# EAGLE schematic prototype_total_schematic_ultasonic (EAGLE 8.4.1)

## Sheet 1 of 2: Peripherals
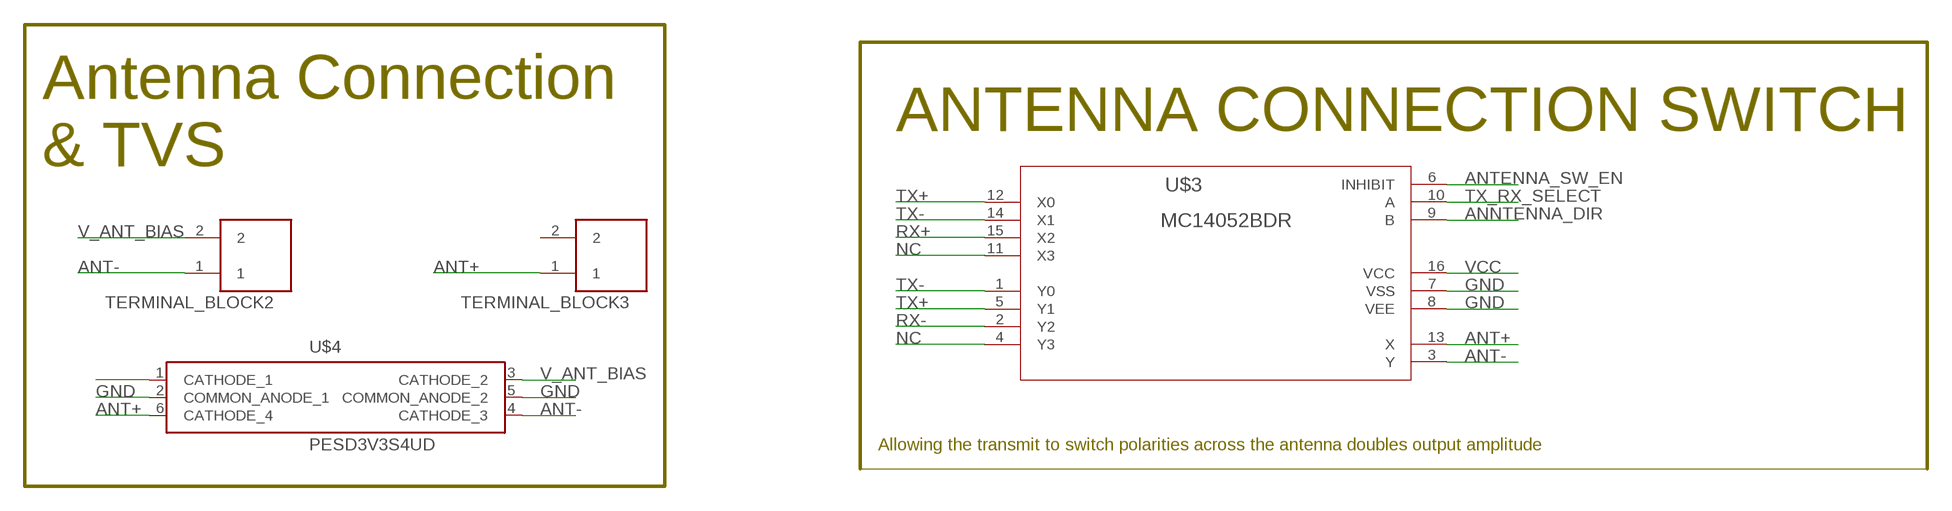
[diagram p0: schematic, sheet 1, part 1 of 2]
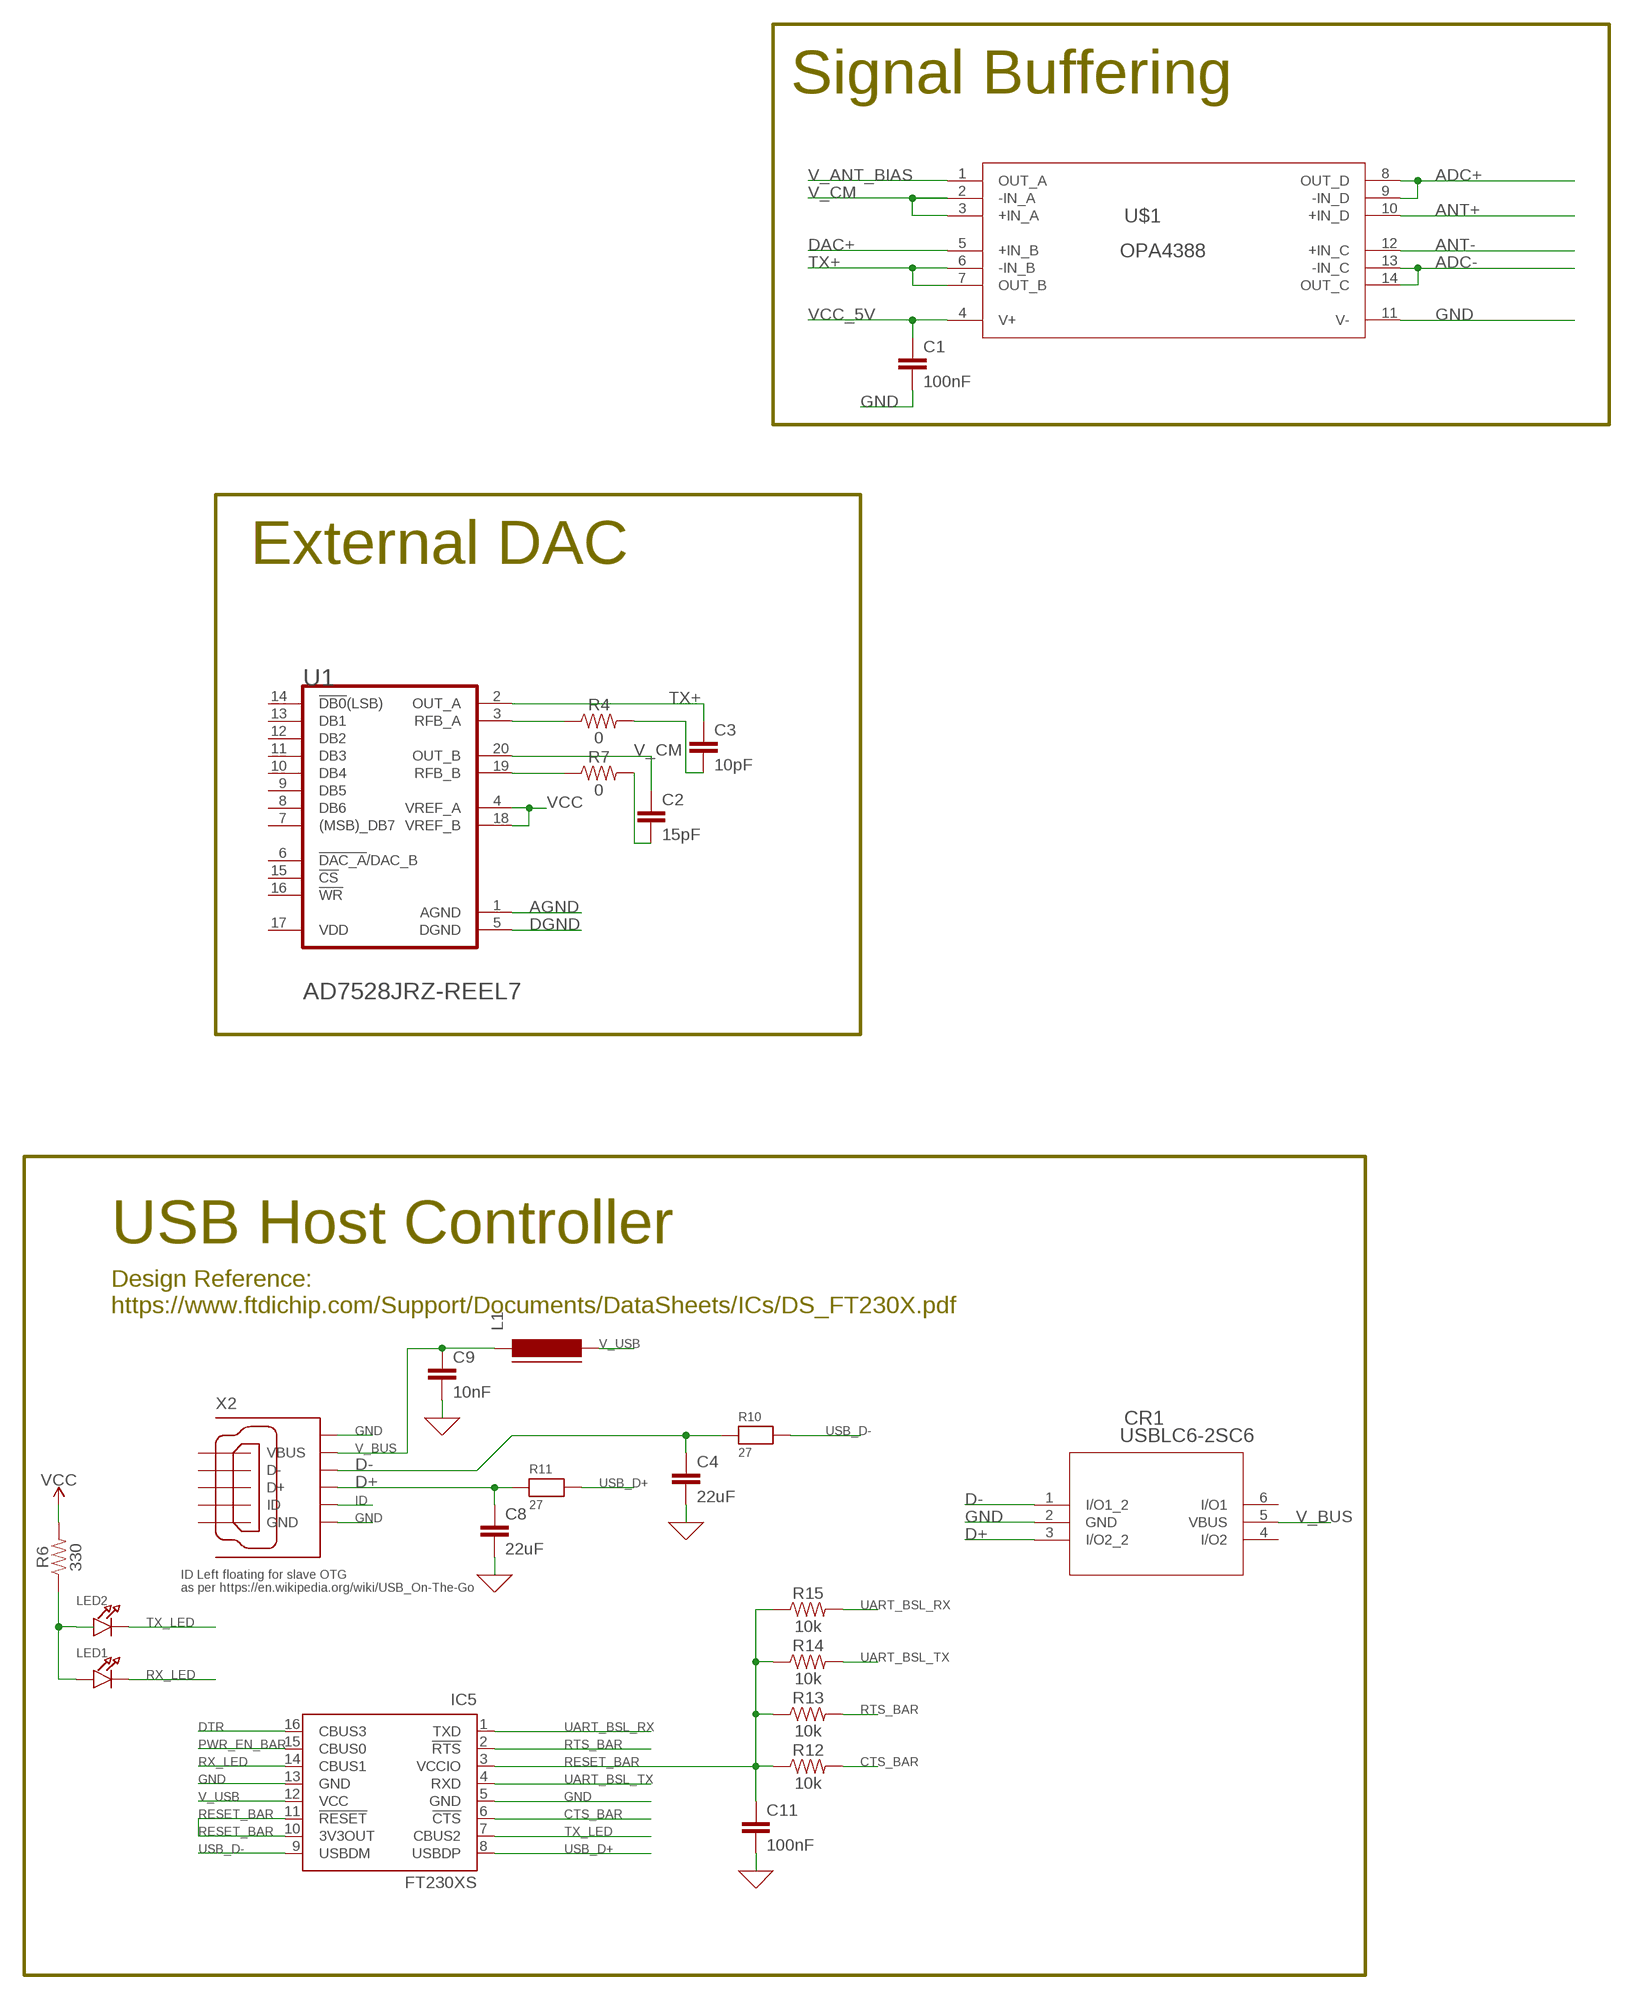
[diagram p1: schematic, sheet 1, part 2 of 2]

### Parts
C1  100nF  22UF-0805-6.3V-20%  [0805]
C2  15pF  22UF-0805-6.3V-20%  [0805]
C3  10pF  22UF-0805-6.3V-20%  [0805]
C4  22uF  22UF-0805-6.3V-20%  [0805]
C8  22uF  22UF-0805-6.3V-20%  [0805]
C9  10nF  22UF-0805-6.3V-20%  [0805]
C11  100nF  22UF-0805-6.3V-20%  [0805]
CR1  USBLC6-2SC6  [SOT23-6L]
IC5  FT230XS  [SSOP16]
L1  FERRITE-0805  [FB805]
LED1  LED0805  [CHIPLED_0805]
LED2  LED0805  [CHIPLED_0805]
R4  0  RESISTOR0805  [0805]
R6  330  2.0KOHM-0603-1/10W-5%  [0603]
R7  0  RESISTOR0805  [0805]
R10  27  RESISTOR0805_NOTHERMALS  [0805_NOTHERMALS]
R11  27  RESISTOR0805_NOTHERMALS  [0805_NOTHERMALS]
R12  10k  2.0KOHM-0603-1/10W-5%  [0603]
R13  10k  2.0KOHM-0603-1/10W-5%  [0603]
R14  10k  2.0KOHM-0603-1/10W-5%  [0603]
R15  10k  2.0KOHM-0603-1/10W-5%  [0603]
TERMINAL_BLOCK2  ED555/2DS  [ED555/2DS]
TERMINAL_BLOCK3  ED555/2DS  [ED555/2DS]
U1  ANALOG_DEVICES_AD7528JRZ-REEL7ANALOG_DEVICES_AD7528JRZ-REEL7_0_2  [ANALOG_DEVICES_AD7528JRZ-REEL7_2]
U$1  OPA4388  [TSSOP-14]
U$3  MC14052BDR  [N5]
U$4  PESD3V3S4UD  [SOT23-6]
X2  GHI-CONNECTORS_10118192-0001LF  [GHI-CONNECTORS_10118192-0001LF(MICRO-USB-B-AMPHENOL-FCI)]

### Nets
0: C4.2 C8.2 C9.2 C11.2 ; supply symbol labelled GND
ADC+: U$1.8(OUT_D) U$1.9(-IN_D)
ADC-: U$1.13(-IN_C) U$1.14(OUT_C)
AGND: U1.1(AGND) ; also sheet 2
ANNTENNA_DIR: U$3.9(B)
ANT+: TERMINAL_BLOCK3.1 U$1.10(+IN_D) U$3.13(X) U$4.6(CATHODE_4)
ANT-: TERMINAL_BLOCK2.1 U$1.12(+IN_C) U$3.3(Y) U$4.4(CATHODE_3)
ANTENNA_SW_EN: U$3.6(INHIBIT)
CTS_BAR: IC5.6(!CTS) R12.2
D+: C8.1 CR1.3(I/O2_2) R11.1 X2.CGND3(SGND3)
D-: C4.1 CR1.1(I/O1_2) R10.1 X2.CGND4(SGND4)
DAC+: U$1.5(+IN_B)
DGND: U1.5(DGND)
DTR: IC5.16(CBUS3) ; also sheet 2
GND: C1.2 CR1.2(GND) IC5.5(GND) IC5.13(GND) U$1.11(V-) U$3.7(VSS) U$3.8(VEE) U$4.2(COMMON_ANODE_1) U$4.5(COMMON_ANODE_2) X2.CGND1(SGND1) X2.CGND6(SGND6) ; also sheet 2
HIGH-Z: U$4.1(CATHODE_1)
ID: X2.CGND2(SGND2)
N$1: R4.1 U1.3(RFB_A)
N$3: LED1.A LED2.A R6.1
N$7: R7.1 U1.19(RFB_B)
N$9: C2.2 R7.2
N$15: C3.2 R4.2
NC: U$3.4(Y3) U$3.11(X3)
PWR_EN_BAR: IC5.15(CBUS0)
RESET_BAR: C11.1 IC5.3(VCCIO) IC5.10(3V3OUT) IC5.11(!RESET) R12.1 R13.1 R14.1 R15.1
RTS_BAR: IC5.2(!RTS) R13.2 ; also sheet 2
RX+: U$3.15(X2)
RX-: U$3.2(Y2)
RX_LED: IC5.14(CBUS1) LED1.C ; also sheet 2
TX+: C3.1 U1.2(OUT_A) U$1.6(-IN_B) U$1.7(OUT_B) U$3.5(Y1) U$3.12(X0)
TX-: U$3.1(Y0) U$3.14(X1)
TX_LED: IC5.7(CBUS2) LED2.C ; also sheet 2
TX_RX_SELECT: U$3.10(A)
UART_BSL_RX: IC5.1(TXD) R15.2 ; also sheet 2
UART_BSL_TX: IC5.4(RXD) R14.2 ; also sheet 2
USB_D+: IC5.8(USBDP) R11.2
USB_D-: IC5.9(USBDM) R10.2
V_ANT_BIAS: TERMINAL_BLOCK2.2 U$1.1(OUT_A) U$4.3(CATHODE_2)
V_BUS: C9.1 CR1.5(VBUS) L1.1 X2.CGND5(SGND5)
V_CM: C2.1 U1.20(OUT_B) U$1.2(-IN_A) U$1.3(+IN_A)
V_USB: IC5.12(VCC) L1.2
VCC: R6.2 U1.4(VREF_A) U1.18(VREF_B) U$3.16(VCC) ; also sheet 2
VCC_5V: C1.1 U$1.4(V+)
Unconnected: CR1.4(I/O2) CR1.6(I/O1) TERMINAL_BLOCK3.2 U1.6(!DAC_A!/DAC_B) U1.7((MSB)_DB7) U1.8(DB6) U1.9(DB5) U1.10(DB4) U1.11(DB3) U1.12(DB2) U1.13(DB1) U1.14(!DB0!(LSB)) U1.15(!CS!) U1.16(!WR!) X2.D+ X2.D- X2.GND X2.ID X2.VBUS

### Notes on the sheet
- Signal Buffering
- External DAC
- ANTENNA CONNECTION SWITCH
- Antenna Connection 
  & TVS
- USB Host Controller
- Design Reference:
  https://www.ftdichip.com/Support/Documents/DataSheets/ICs/DS_FT230X.pdf
- Allowing the transmit to switch polarities across the antenna doubles output amplitude
- ID Left floating for slave OTG
  as per https://en.wikipedia.org/wiki/USB_On-The-Go

## Sheet 2 of 2: MCU
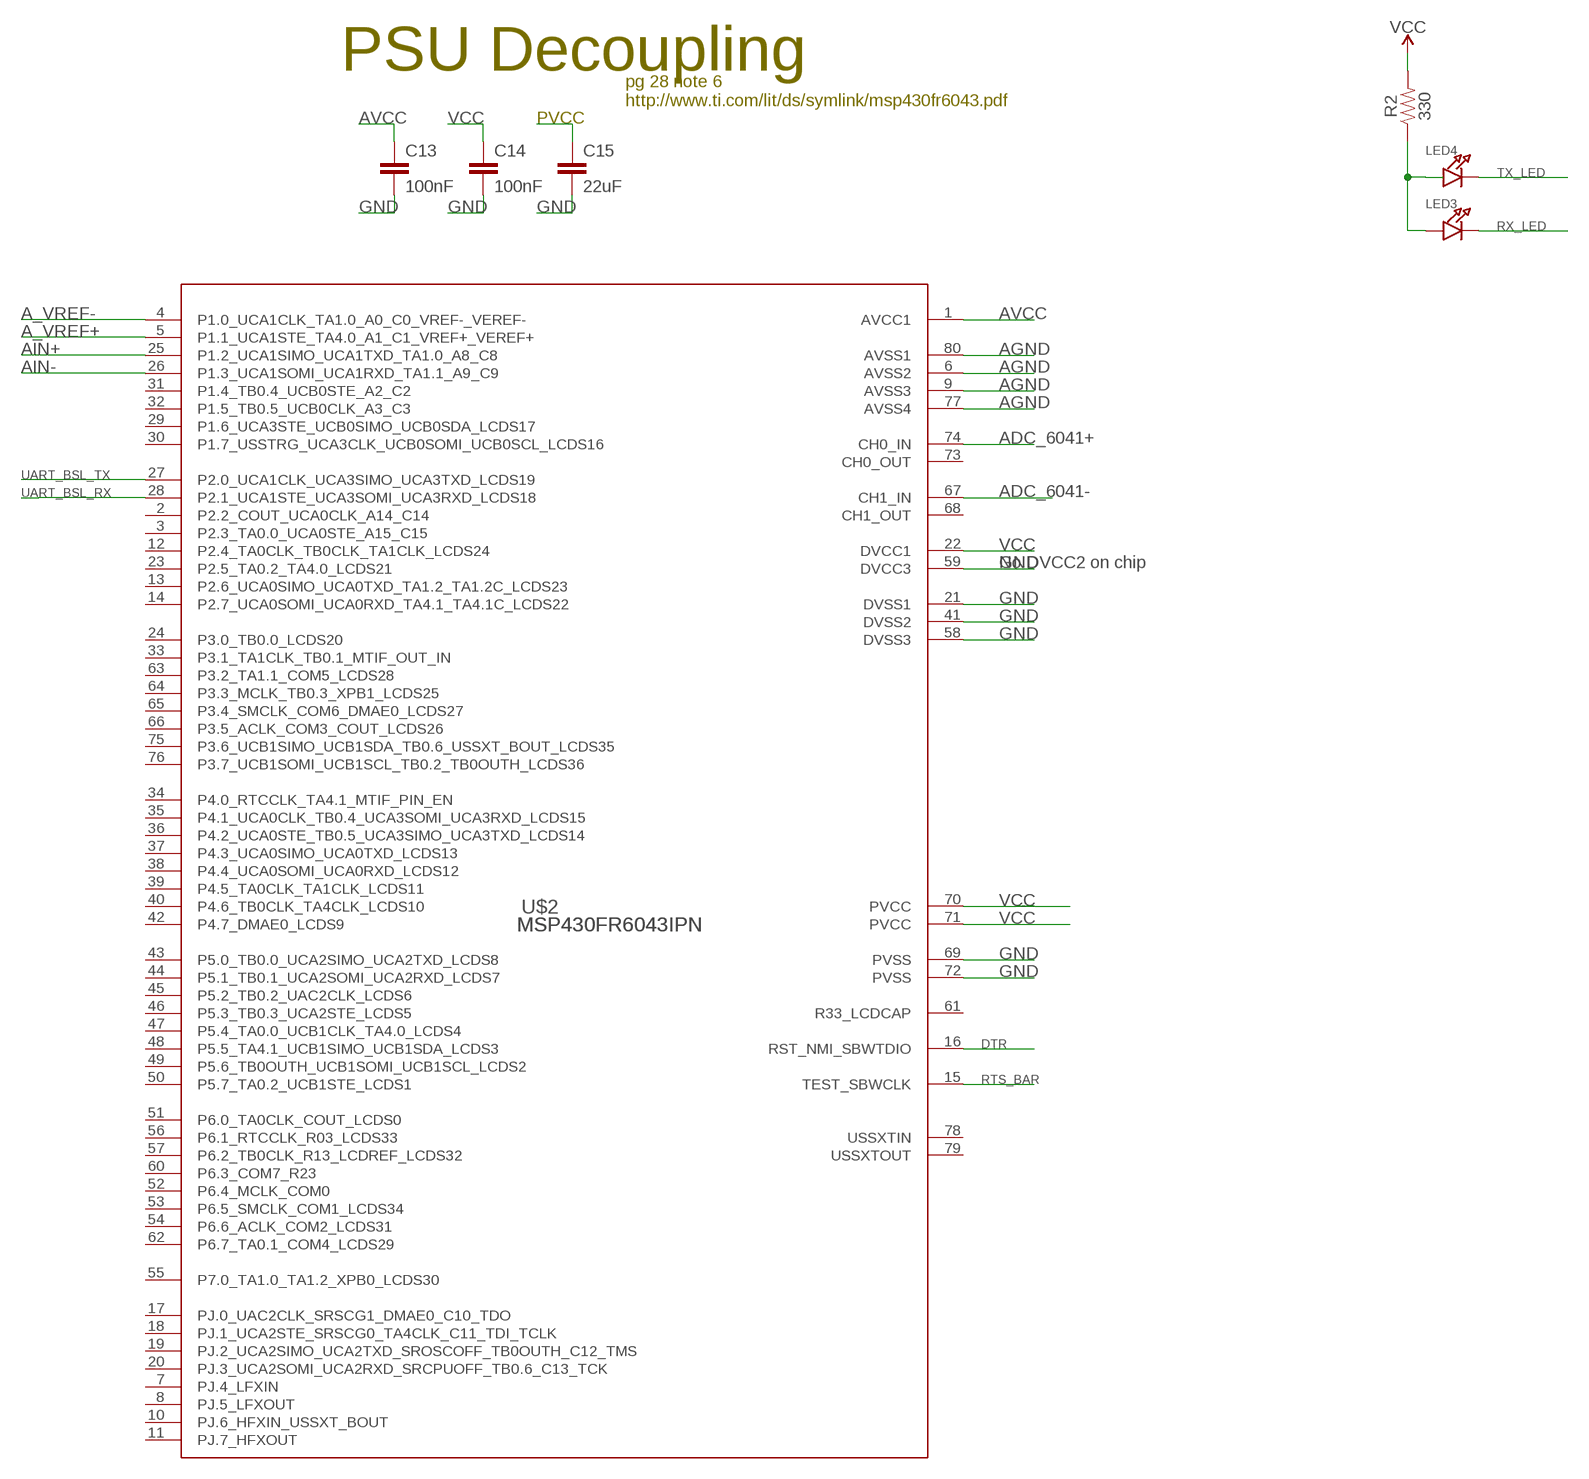
[diagram p2: schematic, sheet 2]

### Parts
C13  100nF  22UF-0805-6.3V-20%  [0805]
C14  100nF  22UF-0805-6.3V-20%  [0805]
C15  22uF  22UF-0805-6.3V-20%  [0805]
LED3  LED0805  [CHIPLED_0805]
LED4  LED0805  [CHIPLED_0805]
R2  330  2.0KOHM-0603-1/10W-5%  [0603]
U$2  MSP430FR6043IPN  [PN0080A_N]

### Nets
A_VREF+: U$2.5(P1.1_UCA1STE_TA4.0_A1_C1_VREF+_VEREF+)
A_VREF-: U$2.4(P1.0_UCA1CLK_TA1.0_A0_C0_VREF-_VEREF-)
ADC_6041+: U$2.74(CH0_IN)
ADC_6041-: U$2.67(CH1_IN)
AGND: U$2.6(AVSS2) U$2.9(AVSS3) U$2.77(AVSS4) U$2.80(AVSS1) ; also sheet 1
AIN+: U$2.25(P1.2_UCA1SIMO_UCA1TXD_TA1.0_A8_C8)
AIN-: U$2.26(P1.3_UCA1SOMI_UCA1RXD_TA1.1_A9_C9)
AVCC: C13.1 U$2.1(AVCC1)
DTR: U$2.16(RST_NMI_SBWTDIO) ; also sheet 1
GND: C13.2 C14.2 C15.2 U$2.21(DVSS1) U$2.41(DVSS2) U$2.58(DVSS3) U$2.59(DVCC3) U$2.69(PVSS) U$2.72(PVSS) ; also sheet 1
N$16: LED3.A LED4.A R2.1
RTS_BAR: U$2.15(TEST_SBWCLK) ; also sheet 1
RX_LED: LED3.C ; also sheet 1
TX_LED: LED4.C ; also sheet 1
UART_BSL_RX: U$2.28(P2.1_UCA1STE_UCA3SOMI_UCA3RXD_LCDS18) ; also sheet 1
UART_BSL_TX: U$2.27(P2.0_UCA1CLK_UCA3SIMO_UCA3TXD_LCDS19) ; also sheet 1
VCC: C14.1 C15.1 R2.2 U$2.22(DVCC1) U$2.70(PVCC) U$2.71(PVCC) ; also sheet 1
Unconnected: U$2.2(P2.2_COUT_UCA0CLK_A14_C14) U$2.3(P2.3_TA0.0_UCA0STE_A15_C15) U$2.7(PJ.4_LFXIN) U$2.8(PJ.5_LFXOUT) U$2.10(PJ.6_HFXIN_USSXT_BOUT) U$2.11(PJ.7_HFXOUT) U$2.12(P2.4_TA0CLK_TB0CLK_TA1CLK_LCDS24) U$2.13(P2.6_UCA0SIMO_UCA0TXD_TA1.2_TA1.2C_LCDS23) U$2.14(P2.7_UCA0SOMI_UCA0RXD_TA4.1_TA4.1C_LCDS22) U$2.17(PJ.0_UAC2CLK_SRSCG1_DMAE0_C10_TDO) U$2.18(PJ.1_UCA2STE_SRSCG0_TA4CLK_C11_TDI_TCLK) U$2.19(PJ.2_UCA2SIMO_UCA2TXD_SROSCOFF_TB0OUTH_C12_TMS) U$2.20(PJ.3_UCA2SOMI_UCA2RXD_SRCPUOFF_TB0.6_C13_TCK) U$2.23(P2.5_TA0.2_TA4.0_LCDS21) U$2.24(P3.0_TB0.0_LCDS20) U$2.29(P1.6_UCA3STE_UCB0SIMO_UCB0SDA_LCDS17) U$2.30(P1.7_USSTRG_UCA3CLK_UCB0SOMI_UCB0SCL_LCDS16) U$2.31(P1.4_TB0.4_UCB0STE_A2_C2) U$2.32(P1.5_TB0.5_UCB0CLK_A3_C3) U$2.33(P3.1_TA1CLK_TB0.1_MTIF_OUT_IN) U$2.34(P4.0_RTCCLK_TA4.1_MTIF_PIN_EN) U$2.35(P4.1_UCA0CLK_TB0.4_UCA3SOMI_UCA3RXD_LCDS15) U$2.36(P4.2_UCA0STE_TB0.5_UCA3SIMO_UCA3TXD_LCDS14) U$2.37(P4.3_UCA0SIMO_UCA0TXD_LCDS13) U$2.38(P4.4_UCA0SOMI_UCA0RXD_LCDS12) U$2.39(P4.5_TA0CLK_TA1CLK_LCDS11) U$2.40(P4.6_TB0CLK_TA4CLK_LCDS10) U$2.42(P4.7_DMAE0_LCDS9) U$2.43(P5.0_TB0.0_UCA2SIMO_UCA2TXD_LCDS8) U$2.44(P5.1_TB0.1_UCA2SOMI_UCA2RXD_LCDS7) U$2.45(P5.2_TB0.2_UAC2CLK_LCDS6) U$2.46(P5.3_TB0.3_UCA2STE_LCDS5) U$2.47(P5.4_TA0.0_UCB1CLK_TA4.0_LCDS4) U$2.48(P5.5_TA4.1_UCB1SIMO_UCB1SDA_LCDS3) U$2.49(P5.6_TB0OUTH_UCB1SOMI_UCB1SCL_LCDS2) U$2.50(P5.7_TA0.2_UCB1STE_LCDS1) U$2.51(P6.0_TA0CLK_COUT_LCDS0) U$2.52(P6.4_MCLK_COM0) U$2.53(P6.5_SMCLK_COM1_LCDS34) U$2.54(P6.6_ACLK_COM2_LCDS31) U$2.55(P7.0_TA1.0_TA1.2_XPB0_LCDS30) U$2.56(P6.1_RTCCLK_R03_LCDS33) U$2.57(P6.2_TB0CLK_R13_LCDREF_LCDS32) U$2.60(P6.3_COM7_R23) U$2.61(R33_LCDCAP) U$2.62(P6.7_TA0.1_COM4_LCDS29) U$2.63(P3.2_TA1.1_COM5_LCDS28) U$2.64(P3.3_MCLK_TB0.3_XPB1_LCDS25) U$2.65(P3.4_SMCLK_COM6_DMAE0_LCDS27) U$2.66(P3.5_ACLK_COM3_COUT_LCDS26) U$2.75(P3.6_UCB1SIMO_UCB1SDA_TB0.6_USSXT_BOUT_LCDS35) U$2.76(P3.7_UCB1SOMI_UCB1SCL_TB0.2_TB0OUTH_LCDS36)

### Notes on the sheet
- PSU Decoupling
- pg 28 note 6
  http://www.ti.com/lit/ds/symlink/msp430fr6043.pdf
- PVCC

## Power pins joined to a net without a drawn wire
CH0_OUT: U$2.73(CH0_OUT)
CH1_OUT: U$2.68(CH1_OUT)
USSXTIN: U$2.78(USSXTIN)
USSXTOUT: U$2.79(USSXTOUT)
VDD: U1.17(VDD)

## Library data of the parts
C1-C3 C9 C11 C13 C14 = SparkFun-Capacitors:22UF: 22µF ceramic capacitors A capacitor is a passive two-terminal electrical component used to store electrical energy temporarily in an electric field.; PROD_ID: CAP-08402; VALUE: 22uF
C4 C8 C15 = SparkFun-Capacitors:22UF: 22µF ceramic capacitors A capacitor is a passive two-terminal electrical component used to store electrical energy temporarily in an electric field.; PROD_ID: CAP-08402
CR1 = TTE:USBLC6-2SC6; MANUFACTURER_PART_NUMBER: USBLC62SC6; VENDOR: STMicroelectronics
IC5 = ftdi:FT230X: USB to BASIC UART IC Auto generated by make-symbol-device-package-bsdl.ulp Rev. 43 Source: Data sheet <http://www.ftdichip.com/Support/Documents/DataSheets/ICs/DS_FT230X.pdf>
L1 = dp_devices:FERRITE: Ferrite bead in various packages
LED1-LED4 = microbuilder:LED: LED 0603 - 0603 Surface Mount Package 2mA: Green LED - Low Power (3.9mcd, 2ma, 1.7Vf) - Digikey: 475-2709-2-ND Orange LED - Low Power (9.8mcd, 2ma, 1.8Vf) - Digikey: 475-1194-2-ND Red LED - Low Power (5mcd, 2ma, 1.8Vf) - Digikey: 475-1195-2-ND Yellow LED - Low Power (7mcd, 2ma, 1.8Vf) - Digikey: 475-1196-2-ND 5mA: Blue LED - Low Power (17mcd, 5ma, 2.9Vf) - Digikey: LNJ937W8CRACT-ND 0805 - 0805 Surface Mount Package 2mA: Red LED (8.8mcd, 2mA, 1.8Vf, Clear) - Low Power [Digikey: 475-2510-1-ND] Green LED (5mcd, 2mA, 1.8Vf, Clear) - Low Power [Digikey: 475-2730-1-ND] Yellow LED (11.3mcd, 2mA, 1.8Vf, Clear) - Low Power [Digikey: 475-2555-1-ND] 20mA: Red LED (104mcd, 20mA, Diffused) - LS R976 [Digikey: 475-1278-6-ND] Red LED (12mcd, 20mA, 2.0Vf, Clear) - APT2012EC [Digikey: 754-1128-1-ND] Green LED (15mcd, 20mA, 2.2Vf, Clear) - APT2012GC [Digikey: 754-1131-1-ND] Orange LED (160mcd, 20mA, 2.1Vf, Clear) - APT2012SECK [Digikey: 754-1130-1-ND] 1206 - 1206 Surface Mount Package Green LED (26mcd, 20mA, Diffused) - LG N971 [Digikey: 475-1407-6-ND] Red LED (15mcd, 20mA, Diffused) - LH N974 [Digikey: 475-1416-6-ND]
R2 R6 R12-R15 = SparkFun-Resistors:2.0KOHM: 2kΩ resistor A resistor is a passive two-terminal electrical component that implements electrical resistance as a circuit element. Resistors act to reduce current flow, and, at the same time, act to lower voltage levels within circuits. - Wikipedia; PROD_ID: RES-08296; VALUE: 2.0k
R4 R7 = SparkFun-Resistors:RESISTOR: Generic Resistor Package
R10 R11 = microbuilder:RESISTOR: Resistors 0402 - 0402 Surface Mount Package 22 Ohm 1% 1/16W [Digikey: 311-22.0LRTR-ND] 33 Ohm 5% 1/16W 1.0K 5% 1/16W 1.5K 5% 1/16W 2.0K 1% 1/16W 10.0K 1% 1/16W [Digikey: 311-10.0KLRTR-ND] 10.0K 5% 1/16W [Digikey: RMCF0402JT10K0TR-ND] 12.1K 1% 1/16W [Digikey: 311-22.0LRTR-ND] 100.0K 5% 1/16W 0603 - 0603 Surface Mount Package 0 Ohm 1/10 Watt 1% Resistor 15 Ohm 1/10 Watt 1% Resistor 33 Ohm 1/10 Watt 1% Resistor 49.9 Ohm 1/10 Watt 1% Resistor 100 Ohm 1/10 Watt 1% Resistor 150 Ohm 1/10 Watt 1% Resistor 240 Ohm 1/10 Watt 1% Resistor 390 Ohm 1/10 Watt 1% Resistor 560 Ohm 1/10 Watt 1% Resistor 680 Ohm 1/10 Watt 1% Resistor 750 Ohm 1/10 Watt 1% Resistor 1.0K Ohm 1/10 Watt 1% Resistor 1.5K Ohm 1/10 Watt 1% Resistor 2.0K Ohm 1/10 Watt 1% Resistor 2.2K Ohm 1/10 Watt 1% Resistor 3.3K Ohm 1/10 Watt 1% Resistor 4.7K Ohm 1/10 Watt 1% Resistor 10.0K Ohm 1/10 Watt 1% Resistor 12.0K Ohm 1/10 Watt 1% Resistor 12.1K Ohm 1/10 Watt 1% Resistor 20.0K Ohm 1/10 Watt 1% Resistor 33.0K Ohm 1/10 Watt 1% Resistor 100.0K Ohm 1/10 Watt 1% Resistor 0805 - 0805 Surface Mount Package 0 Ohm 1/8 Watt 1% Resistor 33 Ohm 1/8 Watt 1% Resistor 100 Ohm 1/8 Watt 1% Resistor 150 Ohm 1/8 Watt 1% Resistor 200 Ohm 1/8 Watt 1% Resistor 240 Ohm 1/8 Watt 1% Resistor 330 Ohm 1/8 Watt 1% Resistor 390 Ohm 1/8 Watt 1% Resistor 470 Ohm 1/8 Watt 1% Resistor 1.0K Ohm 1/8 Watt 1% Resistor 1.5K Ohm 1/8 Watt 1% Resistor 2.0K Ohm 1/8 Watt 1% Resistor 4.7K Ohm 1/8 Watt 1% Resistor 5.1K Ohm 1/8 Watt 1% Resistor 5.6K Ohm 1/8 Watt 1% Resistor 10.0K Ohm 1/8 Watt 1% Resistor 22.0K Ohm 1/8 Watt 1% Resistor 33.0K Ohm 1/8 Watt 1% Resistor 100K Ohm 1/8 Watt 1% Resistor 1206 - 1206 Surface Mount Package 2012 - 2010 Surface Mount Package 0.11 Ohm 1/2 Watt 1% Resistor - Digikey: RHM.11UCT-ND
TERMINAL_BLOCK2 TERMINAL_BLOCK3 = DC_LOAD_AU:ED555/2DS: 2-Pin Terminal Block 3.5mm pitch 6A
U1 = Analog Devices - AD7528JRZ-REEL7:ANALOG_DEVICES_AD7528JRZ-REEL7: ADI-AD7528-RW-20; CIIVA_IDS: 1098916; CODE__JEDEC: MS-013-AC; COMPONENT_LINK_1_DESCRIPTION: Manufacturer URL; COMPONENT_LINK_1_URL: http://www.analog.com/en/index.html; COMPONENT_LINK_3_DESCRIPTION: Package Specification; COMPONENT_LINK_3_URL: http://www.analog.com/static/imported-files/packages/233848RW_20.pdf; COMPONENT_LINK_4_DESCRIPTION: Product URL; COMPONENT_LINK_4_URL: http://www.analog.com/en/digital-to-analog-converters/da-converters/ad7528/products/product.html; DAC_OUTPUTS: 2; DATASHEET: http://www.analog.com/static/imported-files/data_sheets/AD7528.pdf; DATASHEET_VERSION: Rev.B; FOOTPRINT_VARIANT_NAME_0: Level C; FOOTPRINT_VARIANT_NAME_1: Level B; FOOTPRINT_VARIANT_NAME_2: Level A; IMPORTED: yes; IMPORTED_FROM: vault; IMPORT_TS: 1521864376; MAX_V: 15V; MF: Analog Devices; MOUNTING_TECHNOLOGY: Surface Mount; MPN: AD7528JRZ-REEL7; OP_PWR_DISS: 30mW; PACKAGE: RW-20; PACKAGE_DESCRIPTION: 20-Lead Standard Small Outline Package [SOIC_W] Wide Body; PACKAGE_VERSION: 060706-A; PACKING: Reel; PREFIX: U; RELEASE_DATE: 1387039004; RESOLUTION_BITS: 8; ROHS: Yes; SETTLING_TIME: 180ns; SINGLE_SUPPLY: Yes; VAULT_GUID: 5737B697-2E8F-4555-A5E6-F755D0021D01; VAULT_REVISION: 013DC863-C273-4438-B75C-8EA340FAAFD5
U$1 = TTE:OPA4388
U$2 = TTE:MSP430FR6043IPN
U$3 = TTE:MC14052BDR
U$4 = TTE:PESD3V3S4UD
X2 = BeagleBone_Black_Wireless:GHI-CONNECTORS_10118192-0001LF: Amphenol FCI Micro USB Type B Complete Surface Mount (SMT) no guide holes